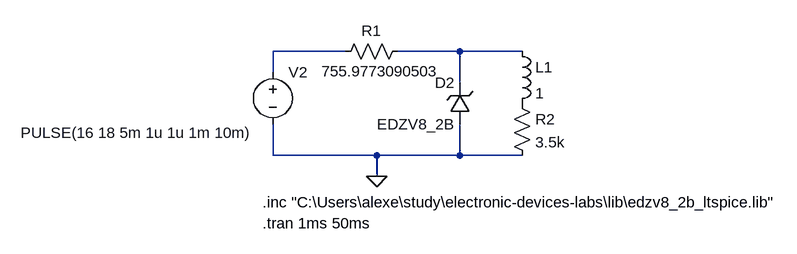
[diagram p0: schematic scheme4.asc]
scheme4.asc, the LTspice schematic file:
Version 4.1
SHEET 1 1416 680
WIRE 0 144 -112 144
WIRE 176 144 80 144
WIRE 272 144 176 144
WIRE -112 176 -112 144
WIRE 176 192 176 144
WIRE -112 304 -112 256
WIRE 48 304 -112 304
WIRE 176 304 176 256
WIRE 176 304 48 304
WIRE 272 304 176 304
WIRE 48 336 48 304
FLAG 48 336 0
SYMBOL voltage -112 160 R0
WINDOW 3 -388 109 Left 2
SYMATTR Value PULSE(16 18 5m 1u 1u 1m 10m)
SYMATTR InstName V2
SYMBOL res 96 128 R90
WINDOW 0 0 56 VBottom 2
WINDOW 3 31 42 VTop 2
SYMATTR InstName R1
SYMATTR Value 755.9773090503
SYMBOL zener 192 256 R180
WINDOW 0 24 64 Left 2
WINDOW 3 24 0 Left 2
SYMATTR InstName D2
SYMATTR Value EDZV8_2B
SYMBOL res 256 208 R0
SYMATTR InstName R2
SYMATTR Value 3.5k
SYMBOL ind 256 128 R0
SYMATTR InstName L1
SYMATTR Value 1
TEXT -128 376 Left 2 !.inc "C:\\Users\\alexe\\study\\electronic-devices-labs\\lib\\edzv8_2b_ltspice.lib"
TEXT -128 408 Left 2 !.tran 1ms 50ms

The netlist it stands for:
* scheme4.asc
V2 N001 0 PULSE(16 18 5m 1u 1u 1m 10m)
R1 N002 N001 755.9773090503
D2 0 N002 EDZV8_2B
R2 P001 0 3.5k
L1 N002 P001 1
.model D D
.lib standard.dio
.inc "C:\Users\alexe\study\electronic-devices-labs\lib\edzv8_2b_ltspice.lib"
.tran 1ms 50ms
.backanno
.end